# Altium schematic sheet USB3.0_UART.SchDoc
size A3
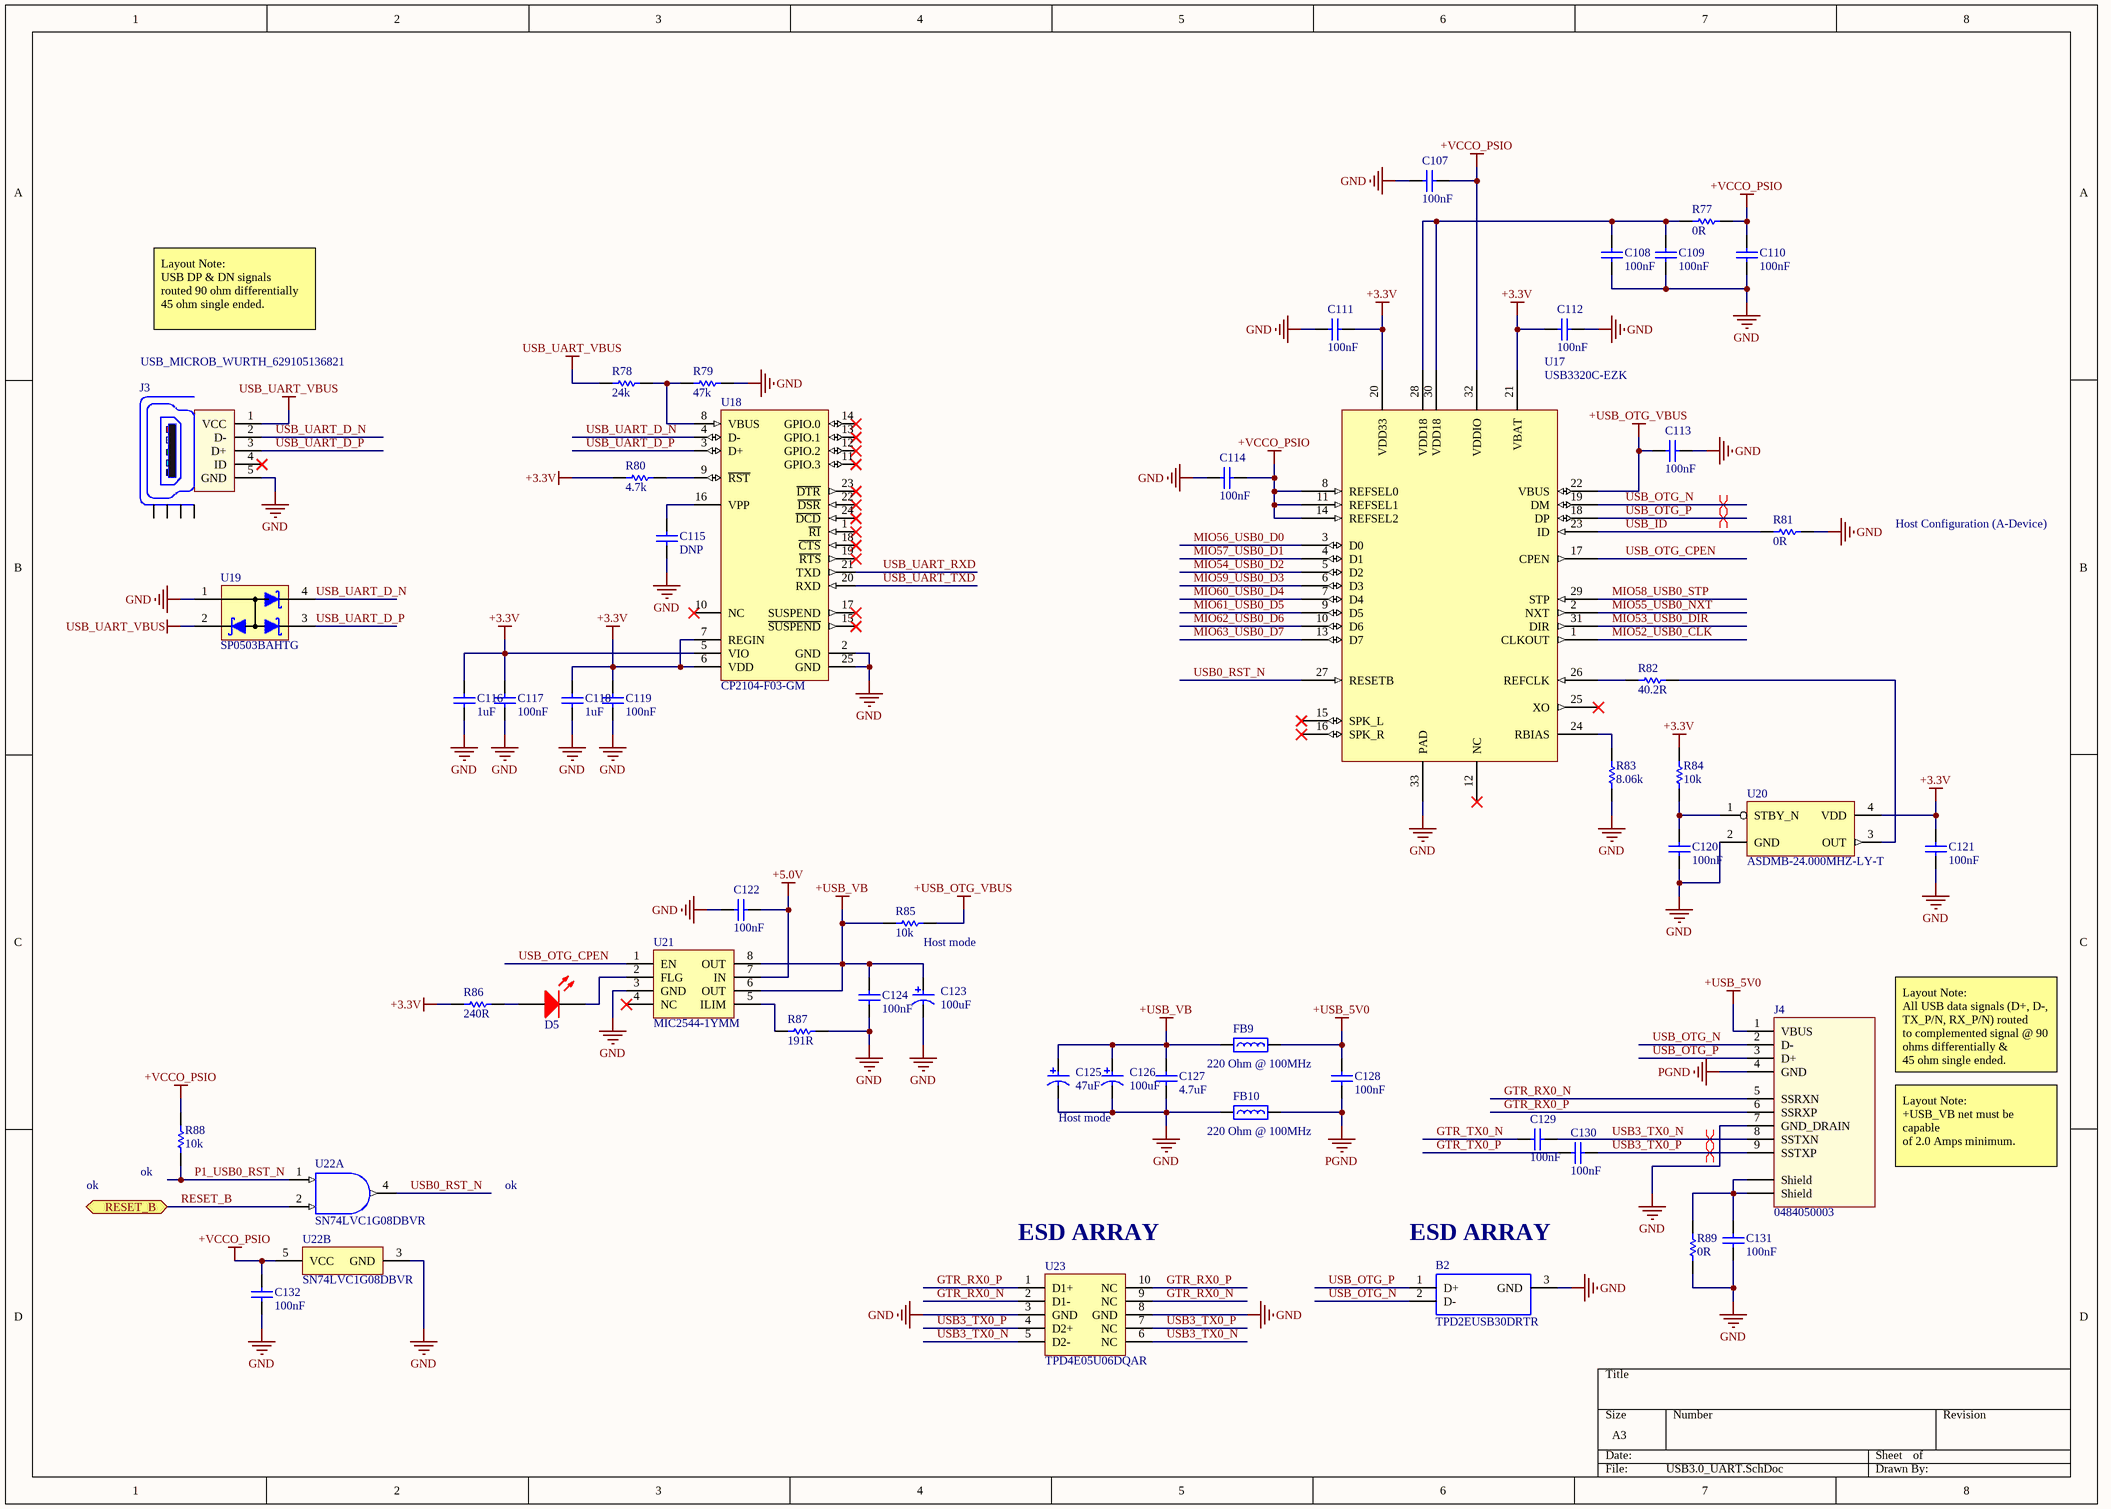
[diagram p0: USB3.0_UART.SchDoc]

## Parts
B2  TPD2EUSB30DRTR  [SOTFL35P100X50-3N]
C107  100nF  [CAPC1005L_0402]
C108  100nF  [CAPC1005L_0402]
C109  100nF  [CAPC1005L_0402]
C110  100nF  [CAPC1005L_0402]
C111  100nF  [CAPC1005L_0402]
C112  100nF  [CAPC1005L_0402]
C113  100nF  [CAPC1005L_0402]
C114  100nF  [CAPC1005L_0402]
C115  DNP  [CAPC1005L_0402]
C116  1uF  [CAPC1005L_0402]
C117  100nF  [CAPC1005L_0402]
C118  1uF  [CAPC1005L_0402]
C119  100nF  [CAPC1005L_0402]
C120  100nF  [CAPC1005L_0402]
C121  100nF  [CAPC1005L_0402]
C122  100nF  [CAPC1005L_0402]
C123  100uF  [AVX_TAN_F95_P_0905]
C124  100nF  [CAPC1005L_0402]
C125  47uF  [AVX_TAN_F38_M_0603]
C126  100uF  [AVX_TAN_F95_P_0905]
C127  4.7uF  [CAPC1005L_0402]
C128  100nF  [CAPC1005L_0402]
C129  100nF  [CAPC1005L_0402]
C130  100nF  [CAPC1005L_0402]
C131  100nF  [CAPC1005L_0402]
C132  100nF  [CAPC1005L_0402]
D5  LED0603RED  [LED0603RED]  (value not drawn)
FB9  Impedance @ Frequency: 220 Ohm @ 100MHz  [INDC1608N_0603]  (hidden comment: BEAD0603_220_2A5_40M)
FB10  Impedance @ Frequency: 220 Ohm @ 100MHz  [INDC1608N_0603]  (hidden comment: BEAD0603_220_2A5_40M)
J3  USB_MICROB_WURTH_629105136821  [USB_MICROB_WURTH_629105136821]
J4  0484050003  [USB30_RA_0484050003]
R77  value 0R  [RESC1005L_0402]  (hidden comment: RES0402_0R_0W1)
R78  value 24k  [RESC1005L_0402]  (hidden comment: RES0402_24K_0W1)
R79  value 47k  [RESC1005L_0402]  (hidden comment: RES0402_47K_0W1)
R80  value 4.7k  [RESC1005L_0402]  (hidden comment: RES0402_4K7_0W1_1T)
R81  value 0R  [RESC1005L_0402]  (hidden comment: RES0402_0R_0W1)
R82  value 40.2R  [RESC1005L_0402]  (hidden comment: RES0402_40R2_0W1_1T)
R83  value 8.06k  [RESC1005L_0402]  (hidden comment: RES0402_8K06_0W1_1T)
R84  value 10k  [RESC1005L_0402]  (hidden comment: RES0402_10K_0W1_05T)
R85  value 10k  [RESC1005L_0402]  (hidden comment: RES0402_10K_0W1_05T)
R86  value 240R  [RESC1005L_0402]  (hidden comment: RES0402_240R_0W1_1T)
R87  value 191R  [RESC1005L_0402]  (hidden comment: RES0402_191R_0W1_1T)
R88  value 10k  [RESC1005L_0402]  (hidden comment: RES0402_10K_0W1_05T)
R89  value 0R  [RESC1005L_0402]  (hidden comment: RES0402_0R_0W1)
U17  USB3320C-EZK  [QFN50P500X500X100_HS-33N]
U18  CP2104-F03-GM  [SLAB-QFN-24-2675x2675TP_L]
U19  SP0503BAHTG  [SP0503BAHT_SOT143]
U20  ASDMB-24.000MHZ-LY-T  [ASDMB]
U21  MIC2544-1YMM  [TPD4E05U06DQAR]
U22  SN74LVC1G08DBVR  [DBV0005A_N]  (parts A,B of 2)
U23  TPD4E05U06DQAR  [TPD4E05U06DQAR]

## Ports
RESET_B

## Nets
+3.3V: C111.2 C112.2 C116.1 C117.1 C118.1 C119.1 C121.1 R80.1 R84.1 R86.1 U17.20(VDD33) U17.21(VBAT) U18.5(VIO) U18.6(VDD) U18.7(REGIN) U20.4(VDD)
+5.0V: C122.2 U21.7(IN)
+USB_5V0: C128.1 FB9.2 J4.1(VBUS)
+USB_OTG_VBUS: C113.1 R85.2 U17.22(VBUS)
+USB_VB: C123.1 C124.1 C125.1 C126.1 C127.2 FB9.1 R85.1 U21.6(OUT) U21.8(OUT)
+VCCO_PSIO: C107.2 C110.2 C114.2 C132.1 R77.2 R88.2 U17.8(REFSEL0) U17.11(REFSEL1) U17.14(REFSEL2) U17.32(VDDIO) U22.5(VCC)
GND: B2.3(GND) C107.1 C108.2 C109.1 C110.1 C111.1 C112.1 C113.2 C114.1 C115.2 C116.2 C117.2 C118.2 C119.2 C120.2 C121.2 C122.1 C123.2 C124.2 C125.2 C126.2 C127.1 C131.2 C132.2 FB10.1 J3.5(GND) J4.7(GND_DRAIN) R79.2 R81.2 R83.2 R87.1 R89.1 U17.33(PAD) U18.2(GND) U18.25(GND) U19.1 U20.2(GND) U21.3(GND) U22.3(GND) U23.3(GND) U23.8(GND)
PGND: C128.2 FB10.2 J4.4(GND)
USB_UART_VBUS: J3.1(VCC) R78.1 U19.2
GTR_RX0_N: J4.5(SSRXN) U23.2(D1-) U23.9(NC)
GTR_RX0_P: J4.6(SSRXP) U23.1(D1+) U23.10(NC)
GTR_TX0_N: C129.1
GTR_TX0_P: C130.1
MIO52_USB0_CLK: U17.1(CLKOUT)
MIO53_USB0_DIR: U17.31(DIR)
MIO54_USB0_D2: U17.5(D2)
MIO55_USB0_NXT: U17.2(NXT)
MIO56_USB0_D0: U17.3(D0)
MIO57_USB0_D1: U17.4(D1)
MIO58_USB0_STP: U17.29(STP)
MIO59_USB0_D3: U17.6(D3)
MIO60_USB0_D4: U17.7(D4)
MIO61_USB0_D5: U17.9(D5)
MIO62_USB0_D6: U17.10(D6)
MIO63_USB0_D7: U17.13(D7)
P1_USB0_RST_N: R88.1 U22.1(A)
RESET_B: U22.2(B) ; port RESET_B
USB0_RST_N: U17.27(RESETB) U22.4(Y)
USB3_TX0_N: C129.2 J4.8(SSTXN) U23.5(D2-) U23.6(NC)
USB3_TX0_P: C130.2 J4.9(SSTXP) U23.4(D2+) U23.7(NC)
USB_ID: R81.1 U17.23(ID)
USB_OTG_CPEN: U17.17(CPEN) U21.1(EN)
USB_OTG_N: B2.2(D-) J4.2(D-) U17.19(DM)
USB_OTG_P: B2.1(D+) J4.3(D+) U17.18(DP)
USB_UART_D_N: J3.2(D-) U18.4(D-) U19.4
USB_UART_D_P: J3.3(D+) U18.3(D+) U19.3
USB_UART_RXD: U18.21(TXD)
USB_UART_TXD: U18.20(RXD)
NetC108_1: C108.1 C109.2 R77.1 U17.28(VDD18) U17.30(VDD18)
NetC115_1: C115.1 U18.16(VPP)
NetC120_1: C120.1 R84.2 U20.1(STBY_N)
NetC131_1: C131.1 J4.MH1(Shield) J4.MH2(Shield) R89.2
NetD5_1: D5.1(A) R86.2
NetD5_2: D5.2(K) U21.2(FLG)
NetR78_2: R78.2 R79.1 U18.8(VBUS)
NetR80_2: R80.2 U18.9(~{RST})
NetR82_1: R82.1 U17.26(REFCLK)
NetR82_2: R82.2 U20.3(OUT)
NetR83_1: R83.1 U17.24(RBIAS)
NetR87_2: R87.2 U21.5(ILIM)

Not connected (* = marked no-connect by the designer): J3 4(ID)* Z1(Shield) Z2(Shield) Z3(Shield) Z4(Shield); U17 12(NC)* 15(SPK_L)* 16(SPK_R)* 25(XO)*; U18 1(~{RI})* 10(NC)* 11(GPIO.3)* 12(GPIO.2)* 13(GPIO.1)* 14(GPIO.0)* 15(~{SUSPEND})* 17(SUSPEND)* 18(~{CTS})* 19(~{RTS})* 22(~{DSR})* 23(~{DTR})* 24(~{DCD})*; U21 4(NC)*

## Layout directives
differential pair: USB3_TX0_N, USB3_TX0_P, USB_OTG_N, USB_OTG_P

## Notes on the sheet
- Layout Note:
  USB DP & DN signals
  routed 90 ohm differentially
  45 ohm single ended.
- Host Configuration (A-Device)
- (near R85) Host mode
- Host mode
- Layout Note:
  All USB data signals (D+, D-,
  TX_P/N, RX_P/N) routed
  to complemented signal @ 90
  ohms differentially &
  45 ohm single ended.
- ok
- (near R88) ok
- Layout Note:
  +USB_VB net must be capable
  of 2.0 Amps minimum.
- (near U23) ESD ARRAY
- (near B2) ESD ARRAY

## Library data of the parts
B2 = D TPD2EUSB30DRTR: Texas Instruments TPD2EUSB30DRTR Dual Bi-Directional TVS Diode Array, 45W peak, 3-Pin SOT; Geometry.Height: 0.5mm; Unidirectional Channels: 2; Voltage - Reverse Standoff (Typ): 5.5V (Max); Voltage - Breakdown (Min): 7V; Voltage - Clamping (Max) @ Ipp: 8V; Current - Peak Pulse (10/1000µs): 1A (8/20µs); Power Line Protection: Yes; Manufacturer_Name: Texas Instruments; Manufacturer_Part_Number: TPD2EUSB30DRTR; Datasheet Link: http://docs-europe.electrocomponents.com/webdocs/1520/0900766b81520865.pdf; Digi-Key Part Number: 296-25509-1-ND; Type: Steering; Power - Peak Pulse: 45W; Operating Temperature: -40°C ~ 85°C (TA); Mounting Type: Surface Mount; Package / Case: SOT-3; Supplier Device Package: SOT-3; Supplier 1: Digi-Key; Supplier Part Number 1: 296-25509-6-ND
C107-C114 C117 C119-C122 C124 C128-C132 = CAPCER0402X7R100N25V_10T: CAP CER 0.1UF 25V X7R 0402; Manufacturer 1: Murata Electronics North America; Manufacturer Part Number 1: GRM155R71E104KE14D; Tolerance: 10%; Package: 0402; ComponentLink1Description: Datasheet; Value: 100nF; Voltage: 25V; Temperature Coefficient: X7R; Supplier 1: Digi-Key; Supplier Part Number 1: 490-10698-1-ND; Operating Temperature: -55°C ~ 125°C
C115 = CAPCER0402: 0402 Package Cap Footprint; Package: 0402; ComponentLink1Description: Datasheet; Value: DNP
C116 C118 = CAPCER0402X5R1U16V_20T: CAP CER 1UF 16V X5R 0402; Manufacturer 1: Murata Electronics North America; Manufacturer Part Number 1: GRM155R61C105ME01D; Tolerance: 20%; Package: 0402; ComponentLink1Description: Datasheet; Value: 1uF; Voltage: 16V; Temperature Coefficient: X5R; Supplier 1: Digi-Key; Supplier Part Number 1: 490-10454-1-ND; Operating Temperature: -55°C ~ 85°C
C123 C126 = CAPELE0905TAN100U6V3_20T: CAP TANT 100UF 6.3V 20% 0805; Manufacturer 1: AVX Corporation; Manufacturer Part Number 1: F950J107MPAAQ2; Temperature Coefficient: Tantalum; ESR: 1.2 Ohm; Package: 0905 P; ComponentLink1Description: Datasheet; ComponentLink1URL: C:\Users\Public\Documents\Altium\AD16\Library\PDF\F95.pdf; Value: 100uF; Voltage: 6.3V; Tolerance: 20%; Supplier 1: Digi-Key; Supplier Part Number 1: 478-8393-1-ND; Operating Temperature: -55°C ~ 125°C
C125 = CAPELE0603TAN47U6V3_20T: CAP TANT POLY 47UF 6.3V SMD; Manufacturer 1: AVX Corporation; Manufacturer Part Number 1: F380J476MMAAXE; Tolerance: 20%; Temperature Coefficient: Tantalum; ESR: 300 mOhm; Package: 0603 M; ComponentLink1Description: Datasheet; ComponentLink1URL: C:\Users\Public\Documents\Altium\AD16\Library\PDF\f38.pdf; Value: 47uF; Voltage: 6.3V; Supplier 1: Digi-Key; Supplier Part Number 1: 478-9399-1-ND; Operating Temperature: -55°C ~ 105°C
C127 = CAPCER0402X5R4U710V_10T: CAP CER 4.7UF 10V X5R 0402; Manufacturer 1: TDK Corporation; Manufacturer Part Number 1: C1005X5R1A475K050BC; Tolerance: 10%; Package: 0402; ComponentLink1Description: Datasheet; Value: 4.7uF; Voltage: 10V; Temperature Coefficient: x5R; Supplier 1: Digi-Key; Supplier Part Number 1: 445-13820-1-ND; Operating Temperature: -55°C ~ 85°C
D5 = LED0603RED: LED RED DIFFUSED 0603 SMD; Manufacturer 1: Broadcom Limited; Manufacturer Part Number 1: HSMH-C191; Voltage - Forward (Vf) (Typ): 1.8V; Current - Test: 20mA; Package: 0603; Supplier 1: Digi-Key; Supplier Part Number 1: 516-3067-1-ND; ComponentLink1Description: Datasheet; ComponentLink1URL: C:\Users\Public\Documents\Altium\AD16\Library\PDF\AV02-0592EN0.pdf
FB9 FB10 = BEAD0603_220_2A5_40M: FERRITE BEAD 220 OHM 0603 1LN; Manufacturer 1: Murata Electronics North America; Manufacturer Part Number 1: BLM18SG221TN1D; Current Rating (Max): 2.5A; DC Resistance (DCR) (Max): 40 mohm; Package: 0603; ComponentLink1Description: Datasheet; ComponentLink1URL: C:\Users\Public\Documents\Altium\AD16\Library\PDF\ENFA0003.pdf; Supplier 1: Digi-Key; Supplier Part Number 1: 490-5225-1-ND; Operating Temperature: -55°C ~ 125°C
J3 = USB_MICROB_WURTH_629105136821: CONN RCPT USB MICRO B R/A SMT; Manufacturer 1: Wurth Electronics Inc; Number of Contacts: 5; Opearating Temperature: -40°C ~ 105°C; ComponentLink1Description: Datasheet; ComponentLink1URL: C:\Users\Public\Documents\Altium\AD16\Library\PDF\629105136821.pdf; Supplier 1: Digi-Key; Manufacturer Part Number 1: 629105136821; Supplier Part Number 1: 732-3155-1-ND
J4 = 0484050003: USB 3.0 RA REC TH TYPE A; Manufacturer 1: Molex, LLC; Number of Contacts: 9; Opearating Temperature: -20°C ~ 85°C; ComponentLink1Description: Datasheet; ComponentLink1URL: C:\Users\Public\Documents\Altium\AD16\Library\PDF\484050003_sd.pdf; Supplier 1: Digi-Key; Manufacturer Part Number 1: 0484050003; Supplier Part Number 1: WM10419-ND
R77 R81 R89 = RES0402_0R_0W1: RES SMD 0 OHM JUMPER 1/10W 0402; Manufacturer 1: Panasonic Electronic Components; Manufacturer Part Number 1: ERJ-2GE0R00X; Package: 0402; ComponentLink1Description: Datasheet; Power: 1/10W; Tolerance: -; Supplier 1: Digi-Key; Supplier Part Number 1: P0.0JCT-ND
R78 = RES0402_24K_0W1: RES SMD 24K OHM 1% 1/10W 0402; Manufacturer 1: Panasonic Electronic Components; Manufacturer Part Number 1: ERJ-2RKF2402X; Package: 0402; ComponentLink1Description: Datasheet; Power: 1/10W; Tolerance: 1%; Supplier 1: Digi-Key; Supplier Part Number 1: P24.0KLCT-ND
R79 = RES0402_47K_0W1: RES SMD 47K OHM 1% 1/10W 0402; Manufacturer 1: Panasonic Electronic Components; Manufacturer Part Number 1: ERJ-2RKF4702X; Package: 0402; ComponentLink1Description: Datasheet; Power: 1/10W; Tolerance: 1%; Supplier 1: Digi-Key; Supplier Part Number 1: P47.0KLCT-ND
R80 = RES0402_4K7_0W1_1T: RES SMD 4.7K OHM 1% 1/10W 0402; Manufacturer 1: Panasonic Electronic Components; Manufacturer Part Number 1: ERJ-2RKF4701X; Package: 0402; ComponentLink1Description: Datasheet; Power: 1/10W; Tolerance: 1%; Supplier 1: Digi-Key; Supplier Part Number 1: P4.70KLCT-ND
R82 = RES0402_40R2_0W1_1T: RES SMD 40.2 OHM 1% 1/10W 0402; Manufacturer 1: Panasonic Electronic Components; Manufacturer Part Number 1: ERJ-2RKF40R2X; Package: 0402; ComponentLink1Description: Datasheet; Power: 1/10W; Tolerance: 1%; Supplier 1: Digi-Key; Supplier Part Number 1: P40.2LCT-ND
R83 = RES0402_8K06_0W1_1T: RES SMD 8.06K OHM 1% 1/10W 0402; Manufacturer 1: Panasonic Electronic Components; Manufacturer Part Number 1: ERJ-2RKF8061X; Package: 0402; ComponentLink1Description: Datasheet; Power: 1/10W; Tolerance: 1%; Supplier 1: Digi-Key; Supplier Part Number 1: P8.06KLCT-ND
R84 R85 R88 = RES0402_10K_0W1_05T: RES SMD 10K OHM 0.5% 1/16W 0402; Manufacturer 1: Panasonic Electronic Components; Manufacturer Part Number 1: ERJ-2RHD1002X; Package: 0402; ComponentLink1Description: Datasheet; Power: 1/16W; Tolerance: 0.5%; Supplier 1: Digi-Key; Supplier Part Number 1: P15984CT-ND
R86 = RES0402_240R_0W1_1T: RES SMD 240 OHM 1% 1/10W 0402; Manufacturer 1: Panasonic Electronic Components; Manufacturer Part Number 1: ERJ-2RKF2400X; Package: 0402; ComponentLink1Description: Datasheet; Power: 1/10W; Tolerance: 1%; Supplier 1: Digi-Key; Supplier Part Number 1: P240LCT-ND
R87 = RES0402_191R_0W1_1T: RES SMD 191 OHM 1% 1/10W 0402; Manufacturer 1: Panasonic Electronic Components; Manufacturer Part Number 1: ERJ-2RKF1910X; Package: 0402; ComponentLink1Description: Datasheet; Power: 1/10W; Tolerance: 1%; Supplier 1: Digi-Key; Supplier Part Number 1: P191LCT-ND
U17 = USB3320C-EZK: IC TXRX USB 2.0 FLEXPWR 32QFN; Manufacturer 1: Microchip Technology; ComponentLink1Description: Datasheet; ComponentLink1URL: C:\Users\Public\Documents\Altium\AD16\Library\PDF\00001792E.pdf; Supplier 1: Digi-Key; Supplier Part Number 1: USB3320C-EZK-ND; Manufacturer Part Number 1: USB3320C-EZK; Operating Temperature: -40°C ~ 85°C
U18 = CP2104-F03-GM: Single-Chip USB to UART Bridge, 4 Dig I/O Pins, Internal Oscillator, 1024 Bytes EEPROM, -40 to 85 degC, 24-pin QFN; Manufacturer 1: Silicon Labs; Internal Oscillator: TRUE; Sub-Family: USB Bridges; DatasheetVersion: Rev. 1.0; PackageReference: QFN-24; PackageDescription: 24-Pin Quad-Flat No-Leads Package, Body 4 x 4 mm, Pitch 0.5 mm; Supplier 1: Digi-Key; Supplier Part Number 1: 336-2008-5-ND; Supplier 2: Mouser; Supplier Part Number 2: 634-CP2104-F03-GM; EEPROM: 1024 Bytes; Mounting Technology: Surface Mount; Code_JEDEC: MO-220; Code_IPC: J-STD-020; Manufacturer Part Number 1: CP2104-F03-GM; ComponentLink1Description: Manufacturer URL; ComponentLink1URL: http://www.silabs.com/; ComponentLink2Description: Datasheet; ComponentLink2URL: C:\Users\Public\Documents\Altium\AD16\Library\PDF\cp2104.pdf; ComponentLink3Description: Package Specification; ComponentLink3URL: http://www.silabs.com/Support%20Documents/TechnicalDocs/C8051F93x-92x.pdf; Operating Temperature: -40°C ~ 85°C
U19 = SP0503BAHTG: IC TXRX USB 2.0 FLEXPWR 32QFN; Manufacturer 1: Littelfuse Inc.; ComponentLink1Description: Datasheet; ComponentLink1URL: C:\Users\Public\Documents\Altium\AD16\Library\PDF\SP05xxBA.pdf; Supplier 1: Digi-Key; Supplier Part Number 1: F2715CT-ND; Manufacturer Part Number 1: SP0503BAHTG; Operating Temperature: -40°C ~ 85°C (TA)
U20 = ASDMB-24.000MHZ-LY-T: OSC MEMS 24.000MHZ CMOS SMD; Manufacturer 1: Abracon LLC; Frequency: 24MHz; Frequency Stability: ±10ppm; ComponentLink1Description: Datasheet; ComponentLink1URL: C:\Users\Public\Documents\Altium\AD16\Library\PDF\ASDMB.pdf; Supplier 1: Digi-Key; Supplier Part Number 1: 535-11186-1-ND; Manufacturer Part Number 1: ASDMB-24.000MHZ-LY-T; Operating Temperature: -40°C ~ 85°C
U21 = MIC2544-1YMM: IC SW CURR LIMIT HI SIDE 8-MSOP; Manufacturer 1: Microchip Technology; Manufacturer Part Number 1: MIC2544-1YMM-TR; ComponentLink1Description: Datasheet; ComponentLink1URL: C:\Users\Public\Documents\Altium\AD16\Library\PDF\20005725B.pdf; Supplier 1: Digi-Key; Supplier Part Number 1: MIC2544-1YMM-CT-ND; Operating Temperature: -40 to +85 Celcius
U22 = SN74LVC1G08DBVR: Single 2-Input Positive-AND Gate, DBV0005A, LARGE T&R; Manufacturer 1: Texas Instruments; VCC(Min)(V): 1.65; VCC(Max)(V): 5.5; Output Type: CMOS; ICC @ Nom Voltage(Max)(mA): 0.01; Input Type: CMOS/TTL; Bits(#): 1; F @ Nom Voltage(Max)(Mhz): 150; Rating: Catalog; Technology Family: LVC; Voltage(Nom)(V): 1.8,2.5,3.3,5; Schmitt Trigger: No; Output Drive (IOL/IOH)(Max)(mA): 32/-32; tpd @ Nom Voltage(Max)(ns): 4.5,6,4,5; Logic: True; Gate Type: AND; DatasheetVersion: SCES217Y; PackageReference: DBV0005A; Supplier 2: Mouser; Supplier Part Number 2: 595-SN74LVC1G08DBVR; Supplier 1: Digi-Key; Supplier Part Number 1: 296-11601-2-ND; Supplier 3: Digi-Key; Supplier Part Number 3: 296-11601-1-ND; Supplier 4: Digi-Key; Supplier Part Number 4: 296-11601-6-ND; Generic Part Number: SN74LVC1G08; Operating Temperature: -40°C ~ 125°C; Sub-Family: AND Gate; 3-State Output: No; Manufacturer Part Number 1: SN74LVC1G08DBVR; ComponentLink1Description: Manufacturer URL; ComponentLink1URL: C:\Users\Public\Documents\Altium\AD16\Library\PDF\sn74lvc1g08.pdf
U23 = TPD4E05U06DQAR: TVS DIODE 5.5VWM 14VC 10SON; Manufacturer 1: Texas Instruments; ComponentLink1Description: Datasheet; ComponentLink1URL: C:\Users\Public\Documents\Altium\AD16\Library\PDF\tpd4e05u06.pdf; Supplier 1: Digi-Key; Supplier Part Number 1: 296-35765-1-ND; Manufacturer Part Number 1: TPD4E05U06DQAR; Operating Temperature: -40°C ~ 125°C (TA)